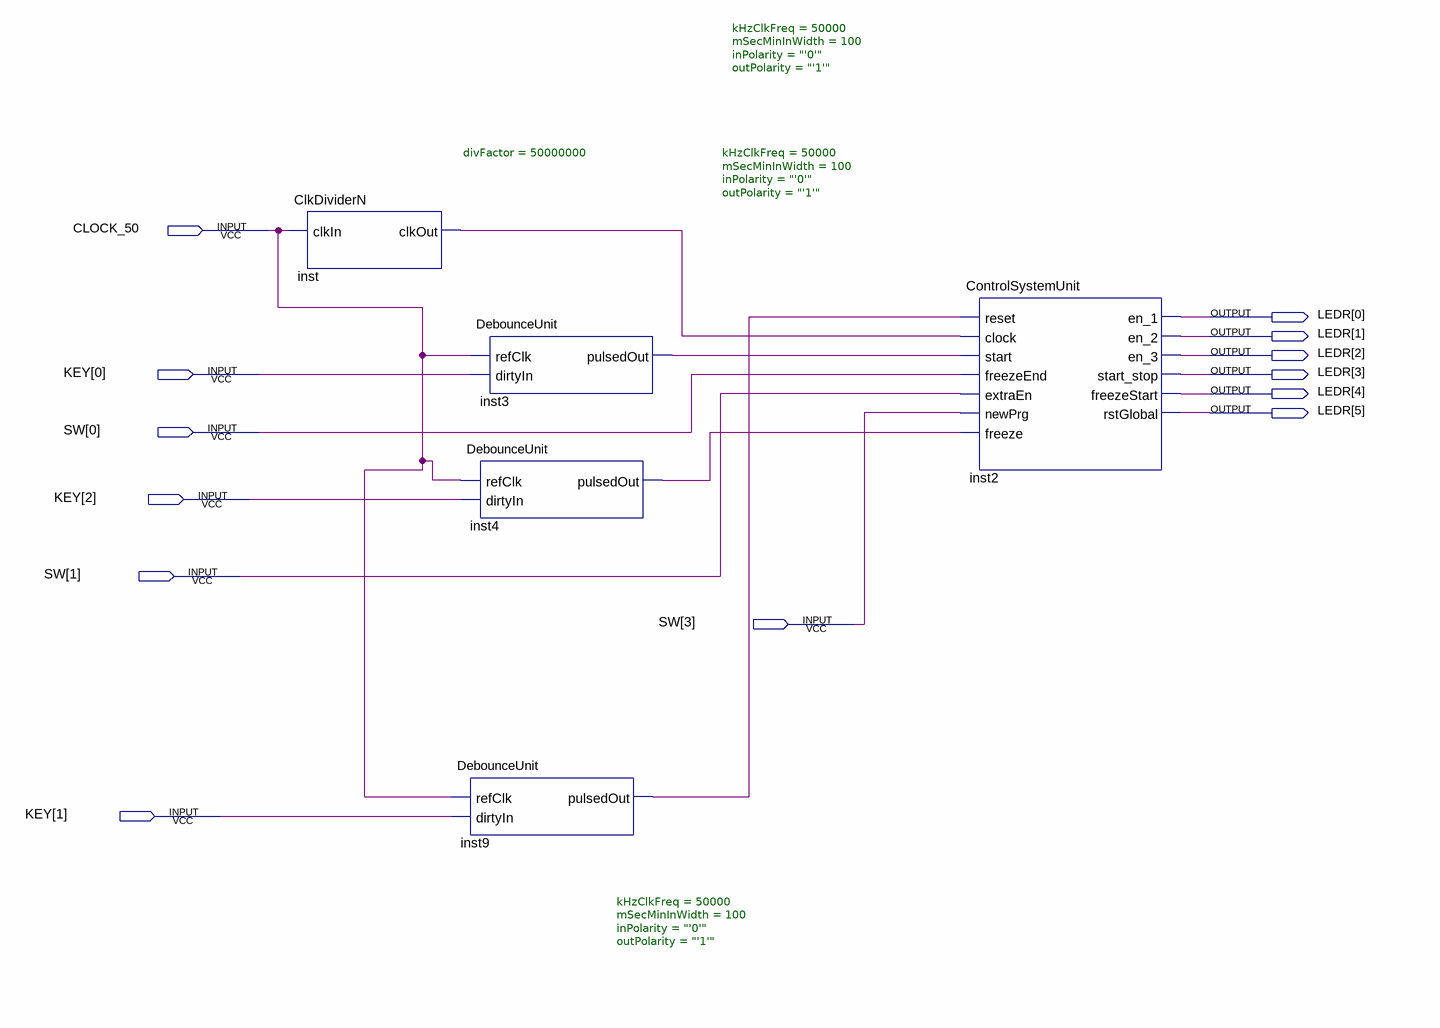
[diagram p0: schematic sheet]
// Quartus schematic demo1.bdf as structural Verilog: 5 symbols, 13 pins
module demo1 (
  input  CLOCK_50,
  input  [2:0] KEY,
  input  [3:0] SW,
  output [5:0] LEDR
);

  wire inst3_pulsedout, inst4_pulsedout, inst9_pulsedout, inst_clkout;

  ClkDividerN #(.divFactor(50000000)) inst (.clkIn(CLOCK_50), .clkOut(inst_clkout));
  DebounceUnit #(.kHzClkFreq(50000), .mSecMinInWidth(100), .inPolarity("'0'"), .outPolarity("'1'")) inst3 (
    .refClk(CLOCK_50), .dirtyIn(KEY[0]), .pulsedOut(inst3_pulsedout));
  DebounceUnit #(.kHzClkFreq(50000), .mSecMinInWidth(100), .inPolarity("'0'"), .outPolarity("'1'")) inst4 (
    .refClk(CLOCK_50), .dirtyIn(KEY[2]), .pulsedOut(inst4_pulsedout));
  DebounceUnit #(.kHzClkFreq(50000), .mSecMinInWidth(100), .inPolarity("'0'"), .outPolarity("'1'")) inst9 (
    .refClk(CLOCK_50), .dirtyIn(KEY[1]), .pulsedOut(inst9_pulsedout));
  ControlSystemUnit inst2 (
    .reset(inst9_pulsedout), .clock(inst_clkout), .start(inst3_pulsedout), .freezeEnd(SW[0]),
    .extraEn(SW[1]), .newPrg(SW[3]), .freeze(inst4_pulsedout), .en_1(LEDR[0]), .en_2(LEDR[1]),
    .en_3(LEDR[2]), .start_stop(LEDR[3]), .freezeStart(LEDR[4]), .rstGlobal(LEDR[5]));
endmodule
